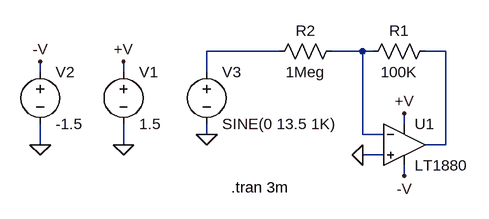
[diagram p0: schematic 1880.asc]
1880.asc, the LTspice schematic file:
Version 4
SHEET 1 896 680
WIRE 0 96 -112 96
WIRE 128 96 80 96
WIRE 144 96 128 96
WIRE 256 96 224 96
WIRE -368 128 -368 112
WIRE -240 128 -240 112
WIRE -112 128 -112 96
WIRE 192 208 192 192
WIRE -112 224 -112 208
WIRE 128 224 128 96
WIRE 160 224 128 224
WIRE -368 240 -368 208
WIRE -240 240 -240 208
WIRE 256 240 256 96
WIRE 256 240 224 240
WIRE 160 256 128 256
WIRE 192 288 192 272
FLAG -240 240 0
FLAG 192 192 +V
FLAG -240 112 +V
FLAG 192 288 -V
FLAG -368 240 0
FLAG -368 112 -V
FLAG -112 224 0
FLAG 128 256 0
SYMBOL voltage -240 112 R0
SYMATTR InstName V1
SYMATTR Value 1.5
SYMBOL voltage -368 112 R0
SYMATTR InstName V2
SYMATTR Value -1.5
SYMBOL res 240 80 R90
WINDOW 0 0 56 VBottom 0
WINDOW 3 32 56 VTop 0
SYMATTR InstName R1
SYMATTR Value 100K
SYMBOL res 96 80 R90
WINDOW 0 0 56 VBottom 0
WINDOW 3 32 56 VTop 0
SYMATTR InstName R2
SYMATTR Value 1Meg
SYMBOL voltage -112 112 R0
SYMATTR InstName V3
SYMATTR Value SINE(0 13.5 1K)
SYMBOL opamps\\LT1880 192 240 R0
SYMATTR InstName U1
TEXT -74 306 Left 0 !.tran 3m

The netlist it stands for:
* 1880.asc
V1 +V 0 1.5
V2 -V 0 -1.5
R1 N003 N002 100K
R2 N002 N001 1Meg
V3 N001 0 SINE(0 13.5 1K)
* U1: LT1880 (symbol opamps\LT1880 not available, pins judged from their places): In+=0 In-=N002 V+=+V V-=-V OUT=N003
.tran 3m
.backanno
.end